# EAGLE design levels (EAGLE 9.6.2)
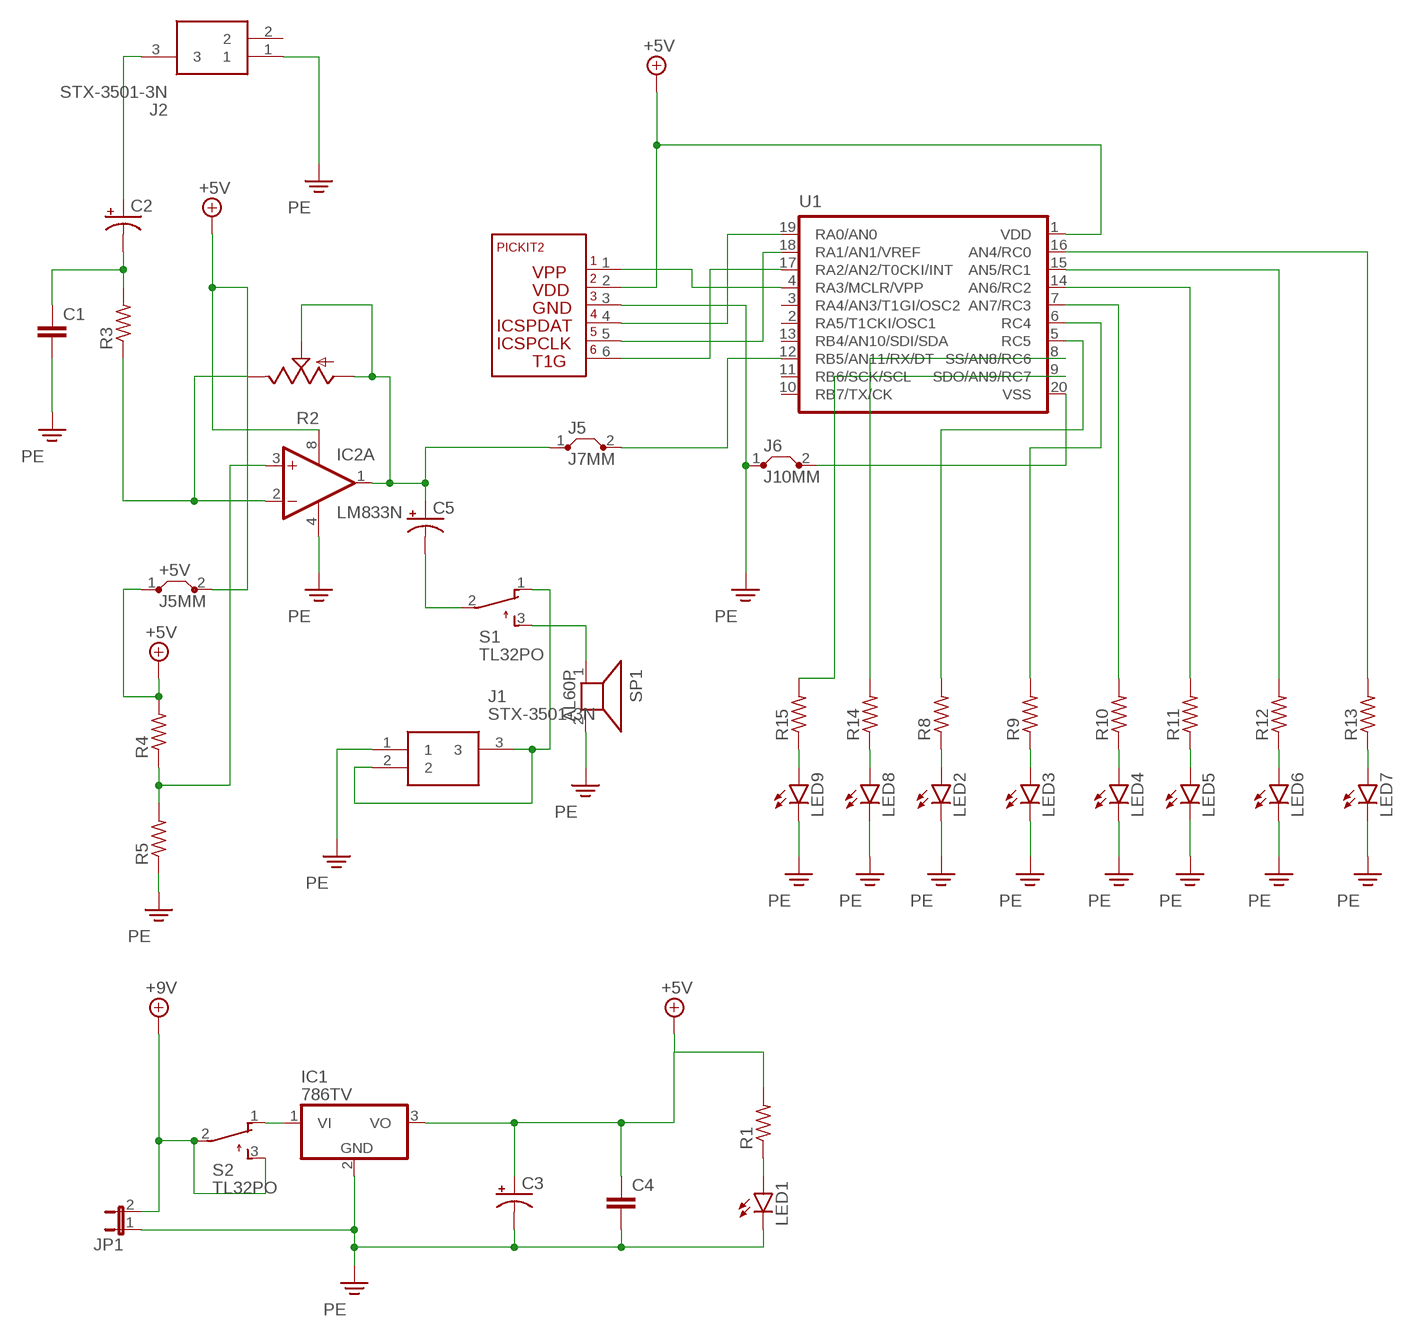
[diagram p0: schematic, sheet 1]

## Parts
+5V  J5MM  [05]
C1  C-EU025-024X044  [C025-024X044]
C2  CPOL-USE3.5-8  [E3,5-8]
C3  CPOL-USE3.5-8  [E3,5-8]
C4  C-EU025-024X044  [C025-024X044]
C5  CPOL-USE3.5-8  [E3,5-8]
IC1  786TV  [TO220V]
IC2  LM833N  [DIL08]
J1  STX-3501-3N  [STX35013N]
J2  STX-3501-3N  [STX35013N]
J5  J7MM  [07]
J6  J10MM  [10]
JP1  JP1E  [JP1]
LED1  LED5MM  [LED5MM]
LED2  LED5MM  [LED5MM]
LED3  LED5MM  [LED5MM]
LED4  LED5MM  [LED5MM]
LED5  LED5MM  [LED5MM]
LED6  LED5MM  [LED5MM]
LED7  LED5MM  [LED5MM]
LED8  LED5MM  [LED5MM]
LED9  LED5MM  [LED5MM]
R1  R-US_0207/10  [0207/10]
R2  TRIM_US-CA6V  [CA6V]
R3  R-US_0207/10  [0207/10]
R4  R-US_0207/10  [0207/10]
R5  R-US_0207/10  [0207/10]
R8  R-US_0207/10  [0207/10]
R9  R-US_0207/10  [0207/10]
R10  R-US_0207/10  [0207/10]
R11  R-US_0207/10  [0207/10]
R12  R-US_0207/10  [0207/10]
R13  R-US_0207/10  [0207/10]
R14  R-US_0207/10  [0207/10]
R15  R-US_0207/10  [0207/10]
S1  TL32PO  [TL3XPO]
S2  TL32PO  [TL3XPO]
SP1  AL60P  [AL60P]
U1  PIC16F6XX  [DIL20]
U$1  PICKIT-ICSP  [PICKITJUMPER]

## Nets
+5V: +5V.1 +5V.2 C3.+ C4.1 IC1.3(VO) IC2.8(P:V+) R1.2 R4.2 U1.1(VDD) U$1.2
+9V: JP1.2 S2.2(P) S2.3(S)
N$1: LED1.A R1.1
N$2: C1.1 C2.- R3.2
N$3: IC1.1(VI) S2.1(O)
N$4: C5.- S1.2(P)
N$5: S1.3(S) SP1.1
N$6: LED2.A R8.1
N$7: LED3.A R9.1
N$8: LED4.A R10.1
N$9: LED5.A R11.1
N$10: LED6.A R12.1
N$11: LED7.A R13.1
N$12: LED8.A R14.1
N$13: LED9.A R15.1
N$14: R13.2 U1.16(AN4/RC0)
N$15: R12.2 U1.15(AN5/RC1)
N$16: R11.2 U1.14(AN6/RC2)
N$17: R10.2 U1.7(AN7/RC3)
N$18: R9.2 U1.6(RC4)
N$19: R8.2 U1.5(RC5)
N$20: R14.2 U1.8(SS/AN8/RC6)
N$21: R15.2 U1.9(SDO/AN9/RC7)
N$22: U1.19(RA0/AN0) U$1.4
N$23: U1.18(RA1/AN1/VREF) U$1.5
N$24: U1.4(RA3/MCLR/VPP) U$1.1
N$25: U1.17(RA2/AN2/T0CKI/INT) U$1.6
N$26: C5.+ IC2.1(A:OUT) J5.1 R2.A R2.S
N$27: IC2.2(A:-IN) R2.E R3.1
N$28: IC2.3(A:+IN) R4.1 R5.2
N$29: C2.+ J2.3
N$30: J1.2 J1.3 S1.1(O)
N$31: J6.2 U1.20(VSS)
N$32: J5.2 U1.12(RB5/AN11/RX/DT)
PE: C1.2 C3.- C4.2 IC1.2(GND) IC2.4(P:V-) J1.1 J2.1 J6.1 JP1.1 LED1.K(C) LED2.K(C) LED3.K(C) LED4.K(C) LED5.K(C) LED6.K(C) LED7.K(C) LED8.K(C) LED9.K(C) R5.1 SP1.2 U$1.3
Unconnected: IC2.5(B:+IN) IC2.6(B:-IN) IC2.7(B:OUT) J2.2 U1.2(RA5/T1CKI/OSC1) U1.3(RA4/AN3/T1GI/OSC2) U1.10(RB7/TX/CK) U1.11(RB6/SCK/SCL) U1.13(RB4/AN10/SDI/SDA)

## Library data of the parts
+5V J5 J6 = jumper:J: Bridge
C1 C4 = rcl:C-EU: CAPACITOR, European symbol; SPICEPREFIX: C
C2 C3 C5 = rcl:CPOL-US: POLARIZED CAPACITOR, American symbol; SPICEPREFIX: C
IC1 = linear:78*: Positive VOLTAGE REGULATOR Source: http://cache.national.com/ds/LM/LM78L05.pdf http://www.fairchildsemi.com/ds/LM/LM7805.pdf
IC2 = linear:LM833: OP AMP
J1 J2 = STX-3501-3N:STX-3501-3N: Phone Connectors 3.5mm S LUGS STEREO 3P THRU HOLE Source: Datasheet <https://4donline.ihs.com/images/VipMasterIC/IC/KYCO/KYCOS02218/KYCOS02218-1.pdf?hkey=EF798316E3902B6ED9A73243A3159BB0> Check availability <https://pricing.snapeda.com/parts/STX-3501-3N/Kycon/view-part?ref=eda>; AVAILABILITY: In Stock; DESCRIPTION: 3.50mm (0.141, 1/8, Mini Plug) - Headphone Phone Jack Stereo (3 Conductor, TRS) Connector Solder; MF: Kycon; MP: STX-3501-3N; PACKAGE: None; PRICE: None; PURCHASE-URL: https://pricing.snapeda.com/search/part/STX-3501-3N/?ref=eda
JP1 = jumper:JP1E: JUMPER
LED1-LED9 = led:LED: LED OSRAM: - CHIPLED LG R971, LG N971, LY N971, LG Q971, LY Q971, LO R971, LY R971 LH N974, LH R974 LS Q976, LO Q976, LY Q976 LO Q996 - Hyper CHIPLED LW Q18S LB Q993, LB Q99A, LB R99A - SideLED LS A670, LO A670, LY A670, LG A670, LP A670 LB A673, LV A673, LT A673, LW A673 LH A674 LY A675 LS A676, LA A676, LO A676, LY A676, LW A676 LS A679, LY A679, LG A679 - Hyper Micro SIDELED® LS Y876, LA Y876, LO Y876, LY Y876 LT Y87S - SmartLED LW L88C, LW L88S LB L89C, LB L89S, LG L890 LS L89K, LO L89K, LY L89K LS L896, LA L896, LO L896, LY L896 - TOPLED LS T670, LO T670, LY T670, LG T670, LP T670 LSG T670, LSP T670, LSY T670, LOP T670, LYG T670 LG T671, LOG T671, LSG T671 LB T673, LV T673, LT T673, LW T673 LH T674 LS T676, LA T676, LO T676, LY T676, LB T676, LH T676, LSB T676, LW T676 LB T67C, LV T67C, LT T67C, LS T67K, LO T67K, LY T67K, LW E67C LS E67B, LA E67B, LO E67B, LY E67B, LB E67C, LV E67C, LT E67C LW T67C LS T679, LY T679, LG T679 LS T770, LO T770, LY T770, LG T770, LP T770 LB T773, LV T773, LT T773, LW T773 LH T774 LS E675, LA E675, LY E675, LS T675 LS T776, LA T776, LO T776, LY T776, LB T776 LHGB T686 LT T68C, LB T68C - Hyper Mini TOPLED® LB M676 - Mini TOPLED Santana® LG M470 LS M47K, LO M47K, LY M47K Source: http://www.osram.convergy.de LUXEON: - LUMILED® LXK2-PW12-R00, LXK2-PW12-S00, LXK2-PW14-U00, LXK2-PW14-V00 LXK2-PM12-R00, LXK2-PM12-S00, LXK2-PM14-U00 LXK2-PE12-Q00, LXK2-PE12-R00, LXK2-PE12-S00, LXK2-PE14-T00, LXK2-PE14-U00 LXK2-PB12-K00, LXK2-PB12-L00, LXK2-PB12-M00, LXK2-PB14-N00, LXK2-PB14-P00, LXK2-PB14-Q00 LXK2-PR12-L00, LXK2-PR12-M00, LXK2-PR14-Q00, LXK2-PR14-R00 LXK2-PD12-Q00, LXK2-PD12-R00, LXK2-PD12-S00 LXK2-PH12-R00, LXK2-PH12-S00 LXK2-PL12-P00, LXK2-PL12-Q00, LXK2-PL12-R00 Source: www.luxeon.com KINGBRIGHT: KA-3528ASYC Source: www.kingbright.com
R1 R3-R5 R8-R15 = rcl:R-US_: RESISTOR, American symbol; SPICEPREFIX: R
R2 = pot:TRIM_US-: POTENTIOMETER
S1 S2 = switch:TL32PO: TINY SWITCH ON - MOM Source: http://www2.produktinfo.conrad.com/datenblaetter/700000-724999/705152-da-01-de-Subminiaturschalter_TL_36YO.pdf
SP1 = buzzer:AL60P: SPEAKER Source: Buerklin; OC_FARNELL: unknown; OC_NEWARK: unknown
U1 = pic16f690:PIC16F6XX
U$1 = TEJ4M1:PICKIT-ICSP: The Jumper for connecting in a PICKIT 2

## Board
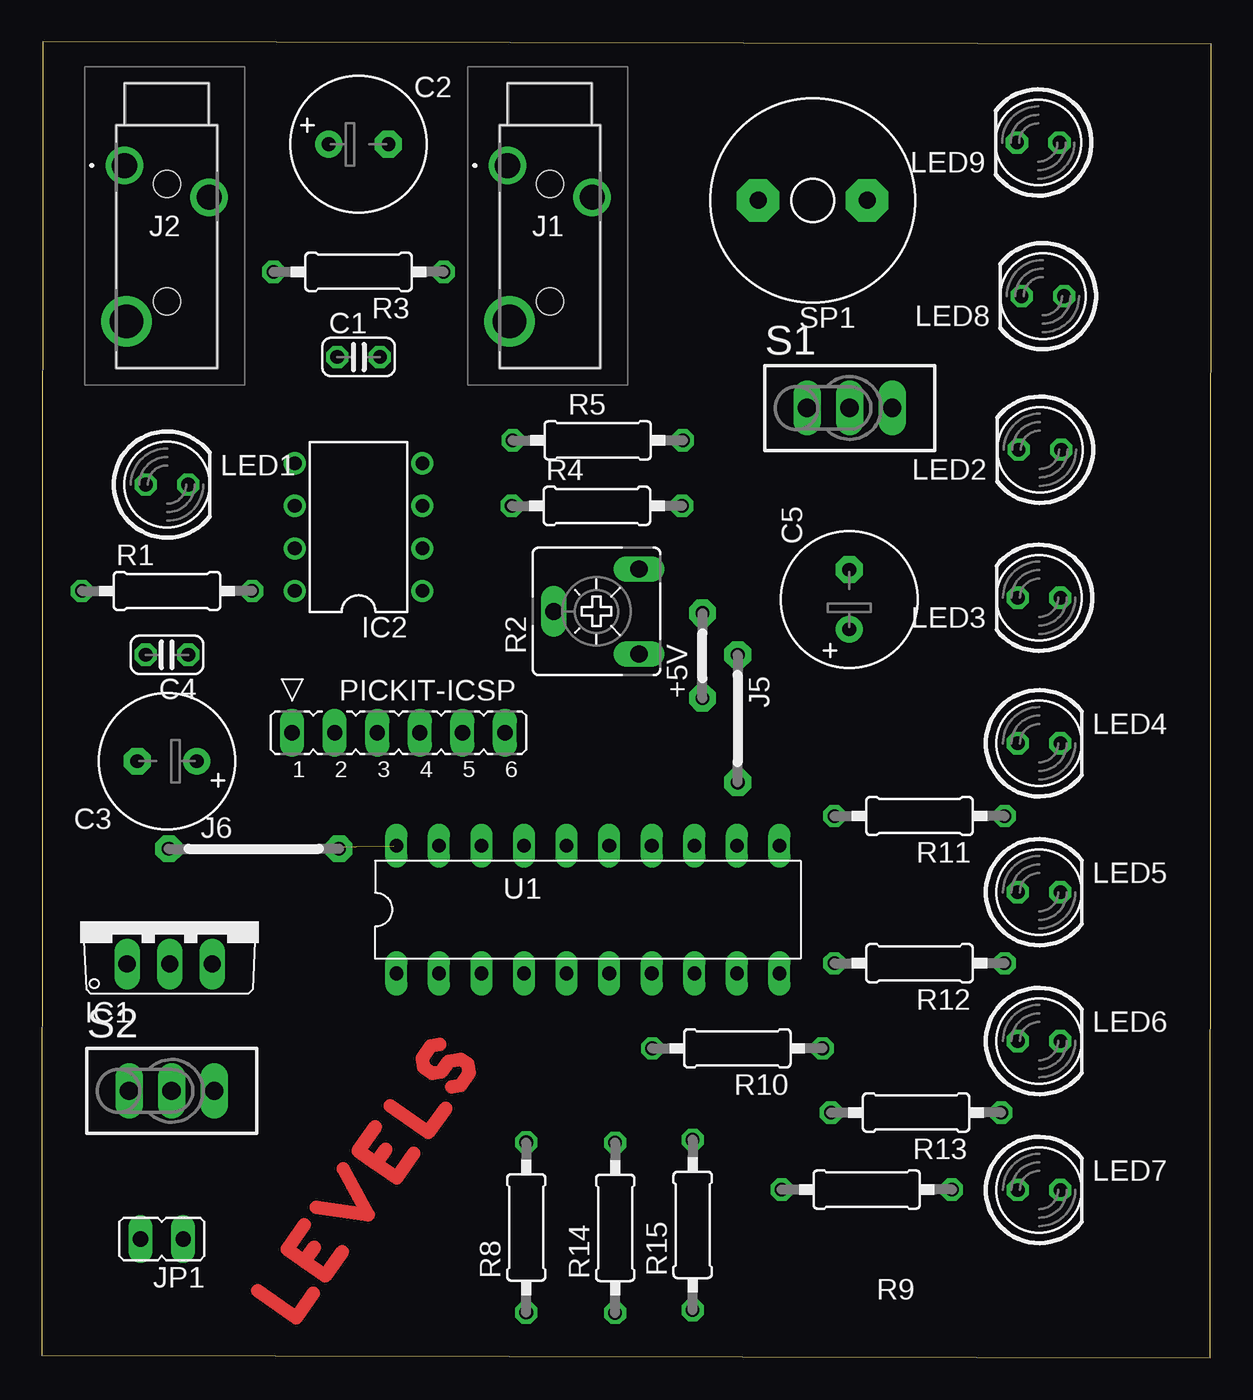
[diagram p1: board, top side]
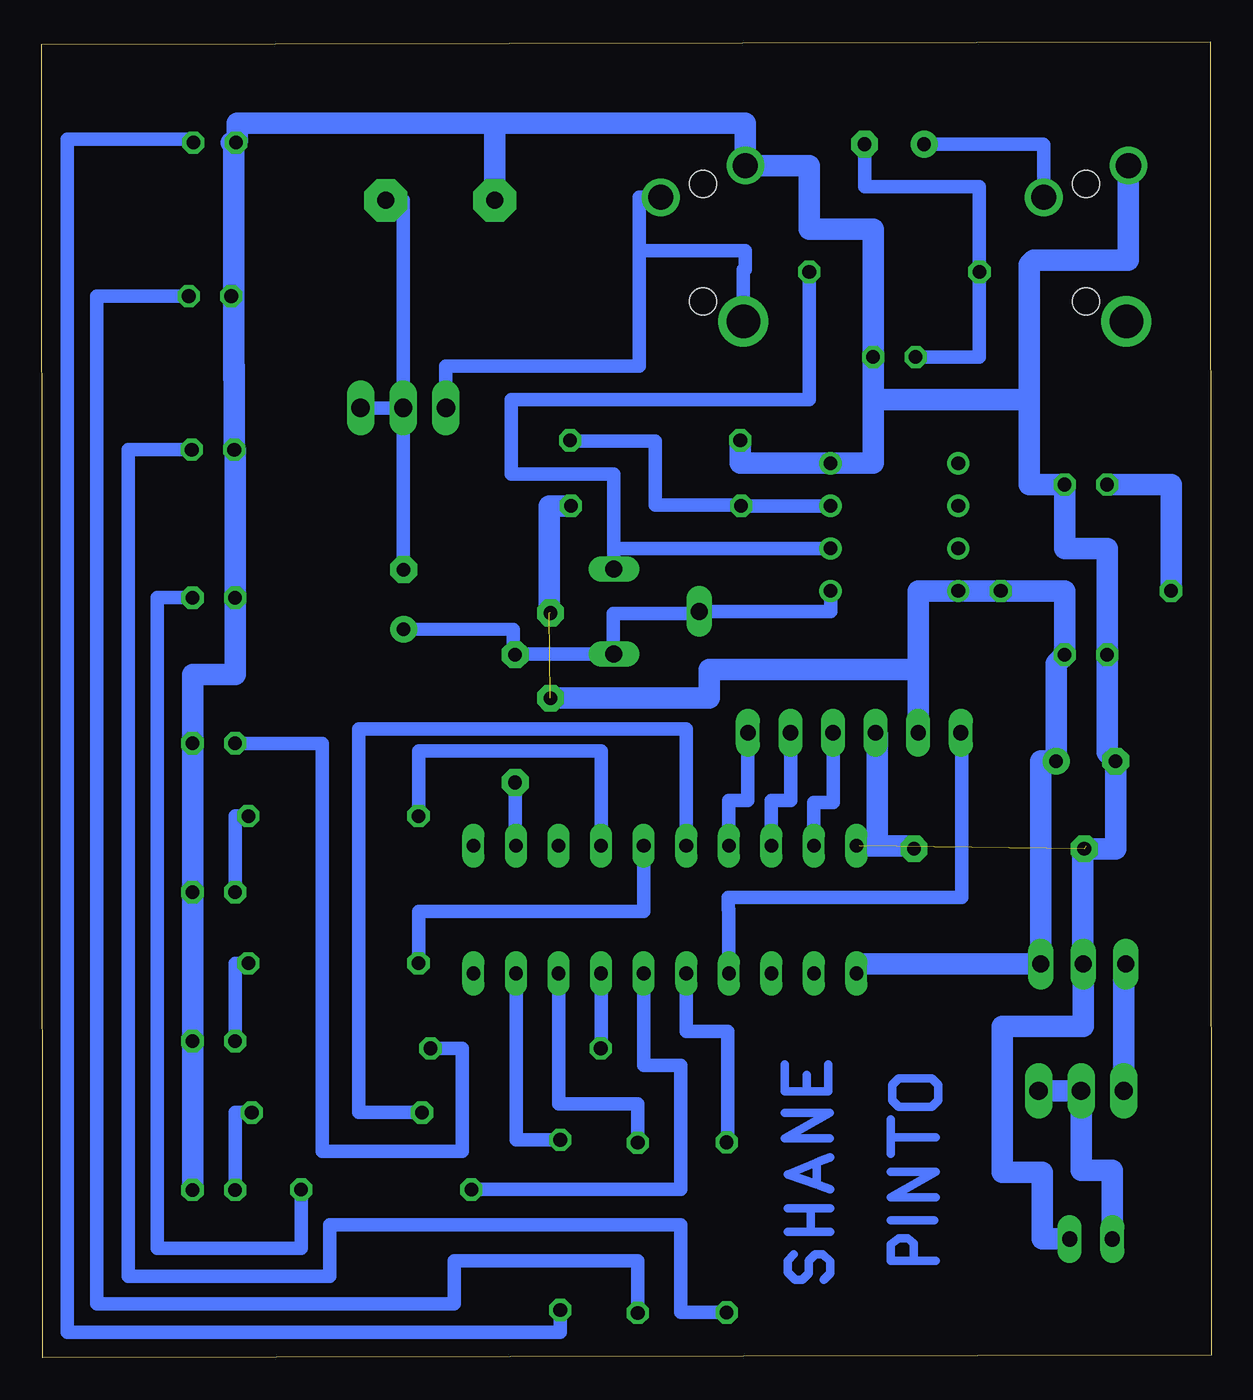
[diagram p2: board, bottom side, seen from below]

Size 69.77 x 78.55 mm. Coordinates in mm from the lower left corner, seen from the top.
Outline: 0,0.15 69.72,0 69.77,78.4 0.05,78.55 0,0.15
Copper layers (1*16): Top 0.035mm / dielectric 1.5mm / Bottom 0.035mm
Design rules "default *": minimum track width 6mil, minimum drill 0.35mm, track to track 6mil, track to pad 6mil, pad to pad 6mil, via to via 6mil, smd to smd 6mil, copper to edge 40mil, drill to drill 6mil, minimum pad ring 10mil, minimum via ring 8mil, stop-mask expansion 4mil, vias tented up to drill 0mil, thermal gap 10mil

### Footprints (pad centres in the part's own frame; a part is rotated, then mirrored left to right if it is on the bottom)
05 = drill 0.813 pad 1.6 octagon: 1 -2.54,0; 2 2.54,0
C025-024X044 = drill 0.813 octagon: 1 -1.27,0; 2 1.27,0
E3,5-8 = drill 0.813 pad 1.6: + -1.778,0 | drill 0.813 pad 1.6 octagon: - 1.778,0
TO220V = drill 1.016 long: 1 -2.54,-2.54; 2 0,-2.54; 3 2.54,-2.54
DIL08 = drill 0.813 pad 1.27: 1 -3.81,-3.81; 2 -1.27,-3.81; 3 1.27,-3.81; 4 3.81,-3.81; 5 3.81,3.81; 6 1.27,3.81; 7 -1.27,3.81; 8 -3.81,3.81
STX35013N = drill 1.5 pad 2.25: 1 0,0; 3 5.05,-1.9 | drill 2 pad 3: 2 0.125,-9.3 | hole 1.6: 2.525,-1.1; 2.525,-8.1
07 = drill 0.813 pad 1.6 octagon: 1 -3.81,0; 2 3.81,0
10 = drill 0.813 pad 1.6 octagon: 1 -5.08,0; 2 5.08,0
JP1 = drill 0.914 long: 1 0,-1.27; 2 0,1.27
LED5MM = drill 0.813 octagon: A -1.27,0; K 1.27,0
0207/10 = drill 0.813 octagon: 1 -5.08,0; 2 5.08,0
CA6V = drill 1.016 long: A -2.54,-2.54; E 2.54,-2.54; S 0,2.54
TL3XPO = drill 1.1 pad 1.422 long: 1 -2.54,0; 2 0,0; 3 2.54,0
AL60P = drill 1.016 pad 2.54 octagon: 1 -3.251,0; 2 3.251,0
DIL20 = drill 0.813 long: 1 -11.43,-3.81; 2 -8.89,-3.81; 3 -6.35,-3.81; 4 -3.81,-3.81; 5 -1.27,-3.81; 6 1.27,-3.81; 7 3.81,-3.81; 8 6.35,-3.81; 9 8.89,-3.81; 10 11.43,-3.81; 11 11.43,3.81; 12 8.89,3.81; 13 6.35,3.81; 14 3.81,3.81; 15 1.27,3.81; 16 -1.27,3.81; 17 -3.81,3.81; 18 -6.35,3.81; 19 -8.89,3.81; 20 -11.43,3.81
PICKITJUMPER = drill 0.914 long: 1 6.35,3.81; 2 3.81,3.81; 3 1.27,3.81; 4 -1.27,3.81; 5 -3.81,3.81; 6 -6.35,3.81

### Placement (x,y rotation side)
+5V  39.42,41.91 90 top
C1  18.9,59.74 0 top
C2  18.9,72.44 0 top
C3  7.47,35.61 180 top
C4  7.47,41.96 180 top
C5  48.18,45.26 90 top
IC1  7.62,26.04 0 top
IC2  18.9,49.58 90 top
J1  27.79,71.17 0 top
J2  4.93,71.17 0 top
J5  41.53,38.15 270 top
J6  12.65,30.38 0 top
JP1  7.16,7.09 90 top
LED1  7.47,52.12 0 top
LED2  59.56,54.2 180 top
LED3  59.51,45.36 180 top
LED4  59.51,36.68 0 top
LED5  59.51,27.79 0 top
LED6  59.51,18.9 0 top
LED7  59.51,10.01 0 top
LED8  59.74,63.37 180 top
LED9  59.46,72.54 180 top
R1  7.47,45.77 0 top
R2  33.1,44.55 90 top
R3  18.9,64.82 180 top
R4  33.12,50.85 0 top
R5  33.17,54.76 0 top
R8  28.91,7.77 90 top
R9  49.23,10.03 180 top
R10  41.5,18.47 180 top
R11  52.37,32.33 180 top
R12  52.37,23.55 180 top
R13  52.17,14.63 180 top
R14  34.21,7.75 90 top
R15  38.84,7.92 90 top
S1  48.21,56.69 0 top
S2  7.75,15.93 0 top
SP1  46,69.09 180 top
U1  32.59,26.75 0 top
U$1  21.29,41.12 180 top

### Tracks (layer width: path | path; a pad name or v marks a point on that pad's centre or on a via)
+5V  (2 unrouted)
  Bottom 1.27: U1.1 21.16,23.49 IC1.3 10.16,35.61 C3.+ 9.25,41.45 C4.1 8.74,45.77 R1.2 IC2.8 17.48,45.77 17.48,41.07 | R4.2 39.5,50.85 39.5,44.45 | U$1.2 17.48,41.07 | +5V.1 29.95,39.37 29.95,41.07 17.48,41.07
+9V
  Bottom 1.27: S2.3 S2.2 7.75,11.18 5.89,11.18 JP1.2
N$1
  Bottom 1.27: R1.1 2.39,52.12 LED1.A
N$2
  Bottom 0.813: C2.- 20.68,69.9 13.82,69.9 R3.2 13.82,59.74 C1.1
N$3
  Bottom 1.27: S2.1 5.21,23.37 IC1.1
N$4
  Bottom 0.813: C5.- 48.21,47.07 S1.2
N$5
  Bottom 0.813: SP1.1 48.21,69.09 48.21,56.69 S1.3
N$6
  Bottom 0.813: LED2.A 64.62,54.2 64.62,4.85 52.6,4.85 52.6,7.92 31.65,7.92 31.65,2.69 R8.1
N$7
  Bottom 0.813: LED3.A 62.89,45.36 62.89,6.53 54.31,6.53 R9.1
N$8
  Bottom 0.813: R10.1 44.68,18.47 44.68,12.32 53.04,12.32 53.04,36.68 LED4.A
N$9
  Bottom 0.813: R11.1 58.24,32.33 LED5.A
N$10
  Bottom 0.813: R12.1 58.24,23.55 LED6.A
N$11
  Bottom 0.813: R13.1 58.24,14.63 LED7.A
N$12
  Bottom 0.813: LED8.A 66.5,63.37 66.5,3.23 45.16,3.23 45.16,5.79 34.21,5.79 R14.1
N$13
  Bottom 0.813: LED9.A 60.73,72.75 68.25,72.75 68.25,1.52 38.84,1.52 R15.1
N$14
  Bottom 0.813: U1.16 31.32,37.54 50.85,37.54 50.85,14.63 R13.2
N$15
  Bottom 0.813: R12.2 47.29,26.64 33.86,26.64 U1.15
N$16
  Bottom 0.813: U1.14 36.4,36.22 47.29,36.22 R11.2
N$17
  Bottom 0.813: U1.7 36.4,18.47 R10.2
N$18
  Bottom 0.813: U1.6 33.86,17.45 31.65,17.45 31.65,10.03 R9.2
N$19
  Bottom 0.813: U1.5 31.32,19.48 28.85,19.48 28.85,12.85 R8.2
N$20
  Bottom 0.813: U1.8 38.94,15.16 34.21,15.16 R14.2
N$21
  Bottom 0.813: U1.9 41.48,13 R15.2
N$22
  Bottom 0.813: U$1.4 22.56,33.15 23.7,33.15 U1.19
N$23
  Bottom 0.813: U$1.5 25.1,33.25 26.24,33.25 U1.18
N$24
  Bottom 0.813: U1.4 28.78,26.75 28.8,26.75 28.8,27.48 14.88,27.48 14.88,37.31 U$1.1
N$25
  Bottom 0.813: 27.56,37.31 U$1.6 27.64,33.25 28.78,33.25 U1.17
N$26
  Bottom 0.813: IC2.1 22.71,44.55 R2.S 30.68,44.42 35.69,44.42 35.69,42.06 R2.A 41.53,42.01 | C5.+ 48.16,43.51 41.63,43.47 41.63,42.01 41.53,42.01 | 41.53,42.01 J5.1
N$27
  Bottom 0.813: R3.1 23.98,57.2 41.76,57.2 41.76,52.76 35.64,52.76 R2.E 35.64,48.31 IC2.2
N$28
  Bottom 0.813: IC2.3 R4.1 28.09,50.9 33.17,50.9 33.17,54.71 38.2,54.71 R5.2
N$29
  Bottom 0.813: C2.+ 10.01,72.44 9.98,72.41 J2.3
N$30
  Bottom 0.813: J1.2 27.91,64.95 27.79,64.95 27.79,66.09 34.14,66.09 | S1.1 45.67,59.18 34.14,59.18 34.14,66.09 | J1.3 34.14,69.27 34.14,66.09
N$31
  Bottom 1.27: U1.20 17.73,30.56 J6.2
N$32
  Bottom 0.813: J5.2 41.53,30.61 U1.12
N$33
  Top 0.813: 12.88,3.98 15.17,2.38 16.19,3.83
N$34
  Top 0.813: 15.67,5.75 14.63,6.48 15.65,7.93 | 15.67,5.75 16.92,4.88 17.94,6.33 | 15.67,5.75 16.25,6.58
N$35
  Top 0.813: 16.38,8.97 19.47,8.52 17.98,11.26
N$36
  Top 0.813: 19.93,11.61 18.89,12.33 19.91,13.79 | 19.93,11.61 21.17,10.73 22.19,12.19 | 19.93,11.61 20.51,12.44
N$37
  Top 0.813: 20.78,15.04 23.07,13.44 24.09,14.89
N$38
  Bottom 0.508: 24.89,6.17 25.27,5.79 25.27,5.11 24.82,4.65 24.38,4.65 24,5.03 24,5.79 23.62,6.17 23.16,6.17 22.73,5.74 22.73,5.03 23.11,4.65
N$39
  Top 0.813: 24.45,16.17 24.98,16.27 25.49,17 25.4,17.53 24.98,17.82 24.28,17.69 23.84,17.07 23.31,16.97 22.79,17.34 22.7,17.87 23.21,18.6 23.74,18.69
N$40
  Bottom 0.508: 25.27,7.52 23.88,7.52 | 23.88,7.52 22.73,7.52 | 23.88,7.52 23.88,8.92 | 23.88,8.92 25.27,8.92 | 23.88,8.92 22.73,8.92
N$41
  Bottom 0.508: 22.73,10.06 23.37,10.28 23.52,10.33 | 23.52,10.33 25.27,10.95 23.52,11.65 | 23.52,11.65 23.37,11.71 22.73,11.96 | 23.52,11.65 23.52,10.33
N$42
  Bottom 0.508: 22.76,13.08 25.43,13.08 22.76,14.6 25.43,14.6
N$43
  Bottom 0.508: 24.13,15.9 22.83,15.9 22.83,17.5 | 24.13,15.9 25.43,15.9 25.43,17.5 | 24.13,15.9 24.13,16.89
N$44
  Bottom 0.508: 17.73,5.77 19.1,5.77 19.1,6.76 18.64,7.14 18.11,7.14 17.73,6.83 17.73,5.77 | 17.73,5.77 16.43,5.77
N$45
  Bottom 0.508: 19.1,8.2 16.51,8.2
N$46
  Bottom 0.508: 19.1,11.1 16.43,11.1 19.1,9.58 16.43,9.58
N$47
  Bottom 0.508: 19.1,12.17 19.1,13.16 | 19.1,13.16 19.1,14.22 | 19.1,13.16 16.43,13.16
N$48
  Bottom 0.508: 18.64,14.99 16.66,14.99 16.28,15.37 16.28,16.28 16.66,16.66 18.64,16.66 19.02,16.28 19.02,15.37 18.64,14.99
PE  (2 unrouted)
  Bottom 0.813: LED8.K 58.47,72.54
  Bottom 1.27: J2.1 4.93,65.52 10.58,65.52 10.86,65.24 10.86,57.2 | 10.86,57.2 10.86,52.12 LED1.K 8.74,48.31 6.2,48.31 C4.2 6.2,36.12 C3.- 5.69,30.38 J6.1 7.65,30.3 7.65,23.52 IC1.2 7.62,19.76 12.45,19.76 12.45,11.05 10.08,11.05 10.08,7.09 JP1.1 | R5.1 28.09,53.39 IC2.4 20.17,53.39 20.17,57.2 | 20.17,57.2 C1.2 20.17,67.36 23.98,67.36 23.98,71.17 J1.1 27.79,73.71 42.75,73.71 | 7.47,30.56 7.47,30.53 | 20.17,57.2 10.86,57.2 | SP1.2 42.75,73.71 | LED7.K LED6.K LED5.K LED4.K 60.78,40.79 58.24,40.79 LED3.K 58.24,54.2 LED2.K 58.29,59.18 58.32,59.18 | 42.75,73.71 58.12,73.71 58.12,72.62 LED9.K 58.32,72.54 | U$1.3 19.91,37.21 19.91,30.56 21.01,30.56 | 58.32,72.54 58.47,72.54 | 58.32,72.54 58.32,59.18 | 58.32,59.18 58.32,58.45